# Altium schematic sheet SoC_Control.SchDoc
size A4; SheetNumber: 16; SheetTotal: 22
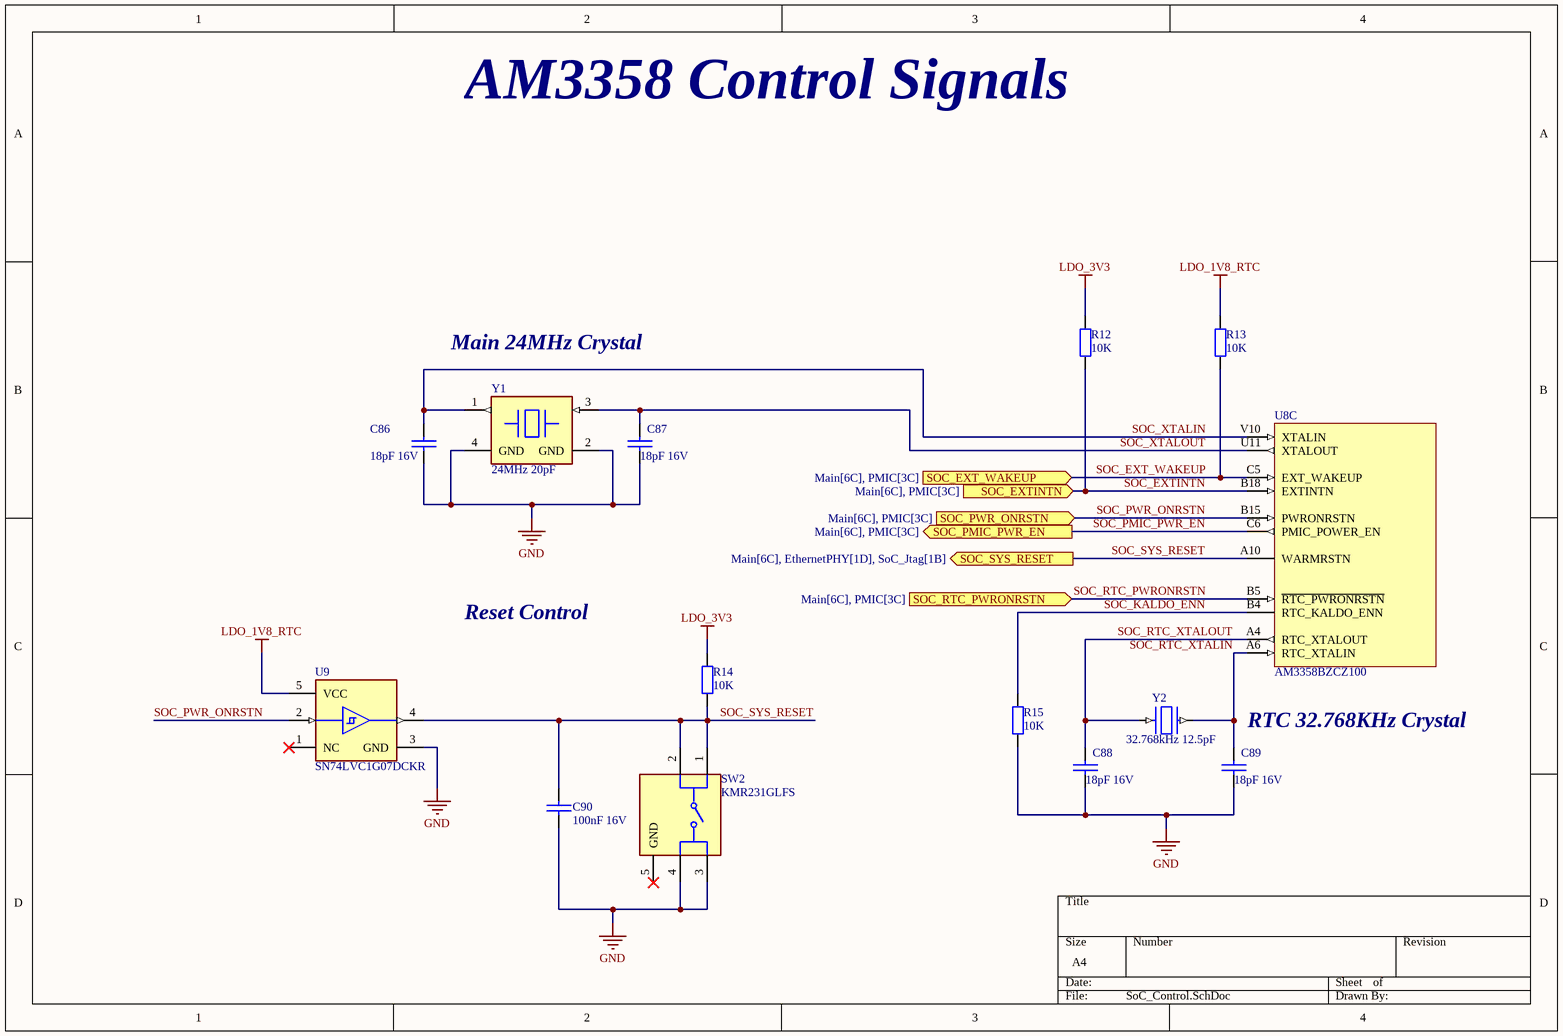
[diagram p0: SoC_Control.SchDoc]

## Parts
C86  18pF 16V  [C_0402]
C87  18pF 16V  [C_0402]
C88  18pF 16V  [C_0402]
C89  18pF 16V  [C_0402]
C90  100nF 16V  [C_0402]
R12  10K  [R_0402]
R13  10K  [R_0402]
R14  10K  [R_0402]
R15  10K  [R_0402]
SW2  KMR231GLFS  [FP-KMR231GLFS-MFG]
U8  AM3358BZCZ100  [BGA324C80P18X18_1500X1500X140]  (part C of 9)
U9  SN74LVC1G07DCKR  [FP-DCK0005A-IPC_C]
Y1  24MHz 20pF  [CRYSTAL_SMD3225-4P]
Y2  32.768kHz 12.5pF  [CRYSTAL_SMD3215-2P]

## Ports
SOC_EXT_WAKEUP (in, see Main[6C], PMIC[3C]), SOC_EXTINTN (in, see Main[6C], PMIC[3C]), SOC_PMIC_PWR_EN (out, see Main[6C], PMIC[3C]), SOC_PWR_ONRSTN (in, see Main[6C], PMIC[3C]), SOC_RTC_PWRONRSTN (in, see Main[6C], PMIC[3C]), SOC_SYS_RESET (out, see Main[6C], EthernetPHY[1D], SoC_Jtag[1B])

## Nets
GND: C86.1 C87.1 C88.1 C89.1 C90.2 R15.1 SW2.3 SW2.4 U9.3(GND) Y1.2(GND) Y1.4(GND)
LDO_1V8_RTC: R13.2 U9.5(VCC)
LDO_3V3: R12.2 R14.2
SOC_EXT_WAKEUP: R13.1 U8.C5(EXT_WAKEUP) ; port SOC_EXT_WAKEUP
SOC_EXTINTN: R12.1 U8.B18(EXTINTN) ; port SOC_EXTINTN
SOC_KALDO_ENN: R15.2 U8.B4(RTC_KALDO_ENN)
SOC_PMIC_PWR_EN: U8.C6(PMIC_POWER_EN) ; port SOC_PMIC_PWR_EN
SOC_PWR_ONRSTN: U8.B15(PWRONRSTN) U9.2(A) ; port SOC_PWR_ONRSTN
SOC_RTC_PWRONRSTN: U8.B5(~{RTC_PWRONRSTN}) ; port SOC_RTC_PWRONRSTN
SOC_RTC_XTALIN: C89.2 U8.A6(RTC_XTALIN) Y2.1
SOC_RTC_XTALOUT: C88.2 U8.A4(RTC_XTALOUT) Y2.2
SOC_SYS_RESET: C90.1 R14.1 SW2.1 SW2.2 U8.A10(WARMRSTN) U9.4(Y) ; port SOC_SYS_RESET
SOC_XTALIN: C86.2 U8.V10(XTALIN) Y1.1(CRYSTAL_1)
SOC_XTALOUT: C87.2 U8.U11(XTALOUT) Y1.3(CRYSTAL_2)

Not connected (* = marked no-connect by the designer): SW2 5(GND)*; U9 1(NC)*

## Notes on the sheet
- AM3358 Control Signals
- Main 24MHz Crystal
- Reset Control
- (near C89) RTC 32.768KHz Crystal

## Library data of the parts
C86-C90 = C_0402: Capacitor 0402 SMD
R12-R15 = R_0402: Resistor 0402 SMD
SW2 = CMP-2000-06516-3: SWITCH TACTILE SPST-NO 0.05A 32V; Switch Travel: 0.25mm; Current Rating: 50mA; Operating Force: 3N; Actuator Type: Standard; Illumination Type: Non-Illuminated; Mechanical Life: 150000Cycles; Insulation Resistance: 1GR; Contact Resistance: 100mR; Actuator Length: 0.5mm; Power Rating: 1W; Throw Configuration: SPST; Switch Function: Off-Mom; Min Operating Temperature: -40°C; Termination: Gull Wing; Orientation: Straight; Lead Free: Lead Free; Width: 2.8mm; Contact Material: Silver; Max Voltage Rating (DC): 32V; Max Current Rating: 50mA; Contact Plating: Silver; Radiation Hardening: No; Depth: 4.6mm; Mount: Surface Mount; Max Operating Temperature: 85°C; Case/Package: SMD/SMT; Contact Current Rating: 50mA; Length: 4.6mm; Package Quantity: 7000; Series: KMR2; REACH SVHC: No SVHC; Packaging: Cut Tape; Voltage Rating (DC): 32V
U8 = AM3358BZCZ100: ARM-ASeries 1GHz NFBGA-324 Microcontrollers (MCU/MPU/SOC) ROHS; Manufacturer: Texas Instruments; Manufacturer Part Number: AM3358BZCZ100; Datasheet Link: https://www.ti.com/lit/ds/symlink/am3358.pdf
U9 = CMP-0859-00290-4: IC BUFF/DVR NON-INVERT SC70-5; Number of Output Lines: 1; Turn-On Delay Time: 8.3ns; Min Supply Voltage: 1.65V; Polarity: Non-Inverting; Quiescent Current: 10uA; Low Level Output Current: 32mA; Nominal Supply Current: 40mA; Logic Function: Buffer; Max Supply Voltage: 5.5V; Number of Bits: 1; Number of Circuits: 1; Contact Plating: Gold; Max Operating Temperature: 125°C; Package Quantity: 1; Number of Channels: 1; Number of Outputs: 1; Case/Package: SC; Number of Gates: 1; Number of Pins: 5; Radiation Hardening: No; Min Operating Temperature: -40°C; Number of Bits per Element: 1; Lead Free: Lead Free; High Level Output Current: 32mA; Number of Input Lines: 1; Number of Inputs: 1; Propagation Delay: 8.3ns; Number of Elements: 1; Packaging: Tape and Reel; Mount: Surface Mount; Termination: SMD/SMT; REACH SVHC: No SVHC
Y1 = X322524MSB4SI: 24MHz Surface Mount Crystal 20pF ±10ppm ±20ppm SMD3225-4P Crystals ROHS; Manufacturer: YXC Crystal Oscillators; Manufacturer Part Number: X322524MSB4SI; Datasheet Link: https://www.lcsc.com/datasheet/lcsc_datasheet_2411121006_YXC-Crystal-Oscillators-X322524MSB4SI_C15643.pdf
Y2 = XKXGI-SUA-32.768K: 32.768kHz Surface Mount Crystal 12.5pF ±20ppm ±30ppm SMD3215-2P Crystals ROHS; Manufacturer: YXC Crystal Oscillators; Manufacturer Part Number: XKXGI-SUA-32.768K; Datasheet Link: https://www.lcsc.com/datasheet/lcsc_datasheet_2210261730_YXC-Crystal-Oscillators-XKXGI-SUA-32-768K_C5213671.pdf